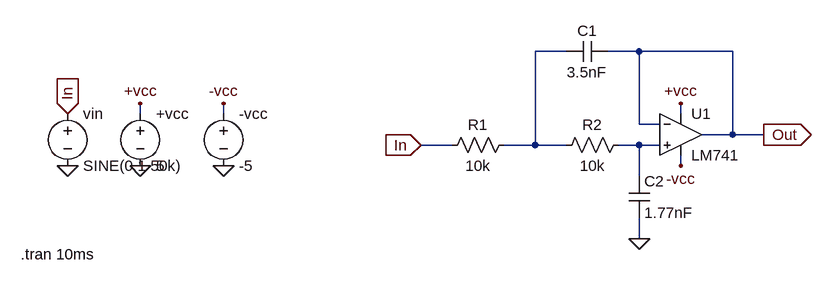
[diagram p0: schematic Draft1.asc]
Draft1.asc, the LTspice schematic file:
Version 4
SHEET 1 880 680
WIRE -16 16 -64 16
WIRE 96 16 48 16
WIRE 240 16 96 16
WIRE -672 112 -672 96
WIRE -544 112 -544 96
WIRE 160 112 160 96
WIRE 96 128 96 16
WIRE 128 128 96 128
WIRE 240 144 240 16
WIRE 240 144 192 144
WIRE 288 144 240 144
WIRE -192 160 -240 160
WIRE -64 160 -64 16
WIRE -64 160 -112 160
WIRE -16 160 -64 160
WIRE 96 160 64 160
WIRE 128 160 96 160
WIRE 160 192 160 176
WIRE 96 208 96 160
WIRE 96 304 96 272
FLAG 96 304 0
FLAG 288 144 Out
IOPIN 288 144 Out
FLAG -240 160 In
IOPIN -240 160 In
FLAG -784 112 In
IOPIN -784 112 In
FLAG -784 192 0
FLAG -672 96 +vcc
FLAG 160 96 +vcc
FLAG 160 192 -vcc
FLAG -672 192 0
FLAG -544 192 0
FLAG -544 96 -vcc
SYMBOL LM741 160 80 R0
SYMATTR InstName U1
SYMBOL res -96 144 R90
WINDOW 0 0 56 VBottom 2
WINDOW 3 32 56 VTop 2
SYMATTR InstName R1
SYMATTR Value 10k
SYMBOL res 80 144 R90
WINDOW 0 0 56 VBottom 2
WINDOW 3 32 56 VTop 2
SYMATTR InstName R2
SYMATTR Value 10k
SYMBOL cap 48 0 R90
WINDOW 0 0 32 VBottom 2
WINDOW 3 32 32 VTop 2
SYMATTR InstName C1
SYMATTR Value 3.5nF
SYMBOL cap 80 208 R0
SYMATTR InstName C2
SYMATTR Value 1.77nF
SYMBOL voltage -672 96 R0
WINDOW 123 0 0 Left 0
WINDOW 39 0 0 Left 0
SYMATTR InstName +vcc
SYMATTR Value 5
SYMBOL voltage -784 96 R0
WINDOW 123 0 0 Left 0
WINDOW 39 0 0 Left 0
SYMATTR InstName vin
SYMATTR Value SINE(0 1 50k)
SYMBOL voltage -544 96 R0
WINDOW 123 0 0 Left 0
WINDOW 39 0 0 Left 0
SYMATTR InstName -vcc
SYMATTR Value -5
TEXT -856 328 Left 2 !.tran 10ms

The netlist it stands for:
* Draft1.asc
XU1 N002 Out +vcc -vcc Out LM741  ; pins In+ In- V+ V- OUT
R1 N001 In 10k
R2 N002 N001 10k
C1 Out N001 3.5nF
C2 N002 0 1.77nF
V§+vcc +vcc 0 5
vin In 0 SINE(0 1 50k)
V§-vcc -vcc 0 -5
.tran 10ms
.lib LM741.lib
.backanno
.end